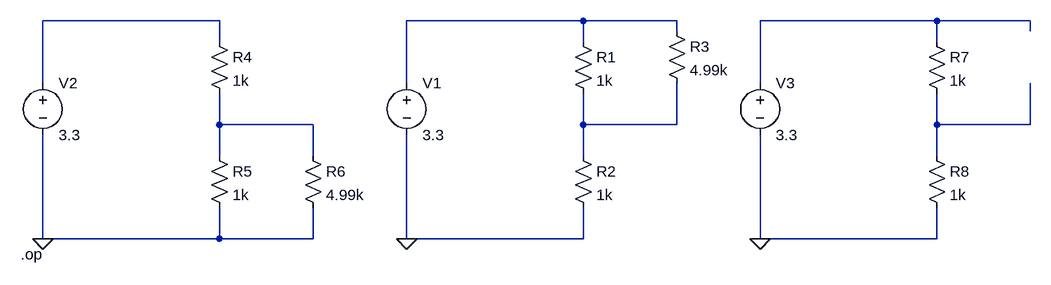
[diagram p0: schematic Hysteresis Divider.asc]
Hysteresis Divider.asc, the LTspice schematic file:
Version 4
SHEET 1 984 680
WIRE -352 16 -624 16
WIRE 208 16 -64 16
WIRE 352 16 208 16
WIRE 752 16 480 16
WIRE 896 16 752 16
WIRE 352 32 352 16
WIRE 896 32 896 16
WIRE -352 48 -352 16
WIRE 208 48 208 16
WIRE 752 48 752 16
WIRE -624 112 -624 16
WIRE -64 112 -64 16
WIRE 480 112 480 16
WIRE -352 176 -352 128
WIRE -208 176 -352 176
WIRE 208 176 208 128
WIRE 352 176 352 112
WIRE 352 176 208 176
WIRE 752 176 752 128
WIRE 896 176 896 112
WIRE 896 176 752 176
WIRE -352 224 -352 176
WIRE -208 224 -208 176
WIRE 208 224 208 176
WIRE 752 224 752 176
WIRE -624 352 -624 192
WIRE -352 352 -352 304
WIRE -352 352 -624 352
WIRE -208 352 -208 304
WIRE -208 352 -352 352
WIRE -64 352 -64 192
WIRE 208 352 208 304
WIRE 208 352 -64 352
WIRE 480 352 480 192
WIRE 752 352 752 304
WIRE 752 352 480 352
FLAG -64 352 0
FLAG -624 352 0
FLAG 480 352 0
DATAFLAG -352 176 ""
DATAFLAG 208 176 ""
DATAFLAG 752 176 ""
SYMBOL voltage -64 96 R0
WINDOW 123 0 0 Left 0
WINDOW 39 0 0 Left 0
SYMATTR InstName V1
SYMATTR Value 3.3
SYMBOL res 192 32 R0
SYMATTR InstName R1
SYMATTR Value 1k
SYMBOL res 192 208 R0
SYMATTR InstName R2
SYMATTR Value 1k
SYMBOL res 336 16 R0
SYMATTR InstName R3
SYMATTR Value 4.99k
SYMBOL voltage -624 96 R0
WINDOW 123 0 0 Left 0
WINDOW 39 0 0 Left 0
SYMATTR InstName V2
SYMATTR Value 3.3
SYMBOL res -368 32 R0
SYMATTR InstName R4
SYMATTR Value 1k
SYMBOL res -368 208 R0
SYMATTR InstName R5
SYMATTR Value 1k
SYMBOL res -224 208 R0
SYMATTR InstName R6
SYMATTR Value 4.99k
SYMBOL res 736 32 R0
SYMATTR InstName R7
SYMATTR Value 1k
SYMBOL res 736 208 R0
SYMATTR InstName R8
SYMATTR Value 1k
SYMBOL voltage 480 96 R0
WINDOW 123 0 0 Left 0
WINDOW 39 0 0 Left 0
SYMATTR InstName V3
SYMATTR Value 3.3
TEXT -658 376 Left 2 !.op

The netlist it stands for:
* Hysteresis Divider.asc
V1 N002 0 3.3
R1 N002 N005 1k
R2 N005 0 1k
R3 N002 N005 4.99k
V2 N001 0 3.3
R4 N001 N004 1k
R5 N004 0 1k
R6 N004 0 4.99k
R7 N003 N006 1k
R8 N006 0 1k
V3 N003 0 3.3
.op
.backanno
.end